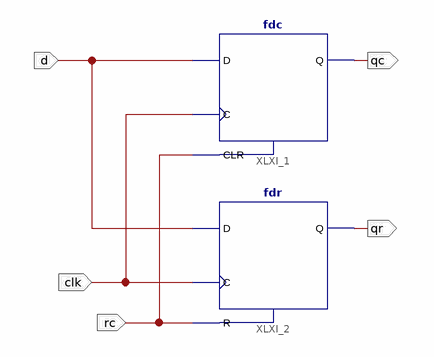
[diagram p0: schematic sheet 1]
// Xilinx ISE schematic FDC_and_FDR.sch (xc9500) as structural Verilog: 2 symbols, 5 ports
module FDC_and_FDR (
  input  d,
  input  clk,
  input  rc,
  output qc,
  output qr
);

  fdc XLXI_1 (.C(clk), .CLR(rc), .D(d), .Q(qc));
  fdr XLXI_2 (.C(clk), .D(d), .R(rc), .Q(qr));
endmodule
